# EAGLE schematic raceCapture (EAGLE 5.09)

## Sheet 1 of 4
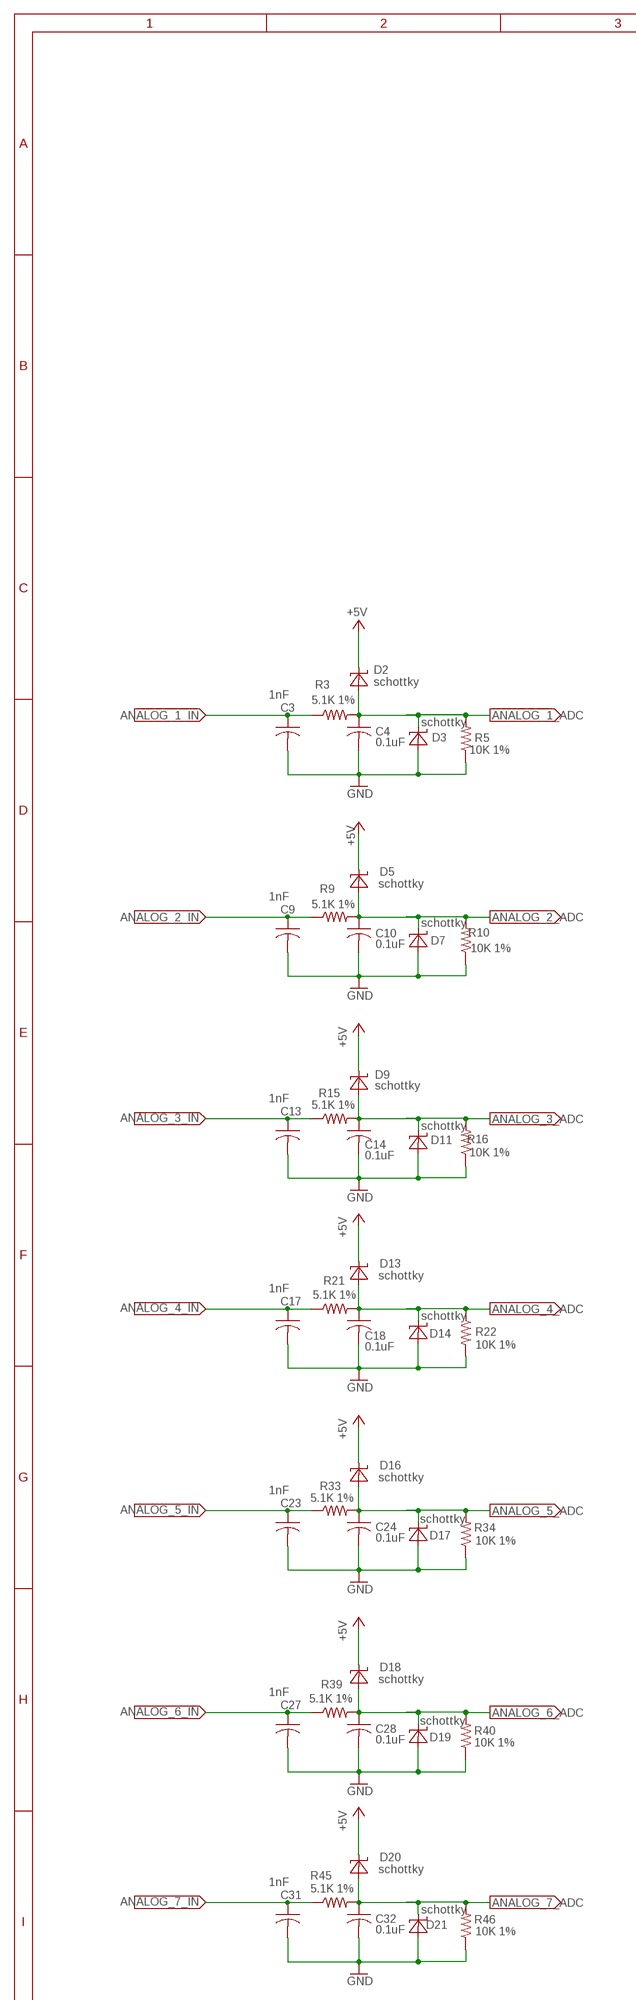
[diagram p0: schematic, sheet 1, part 1 of 2]
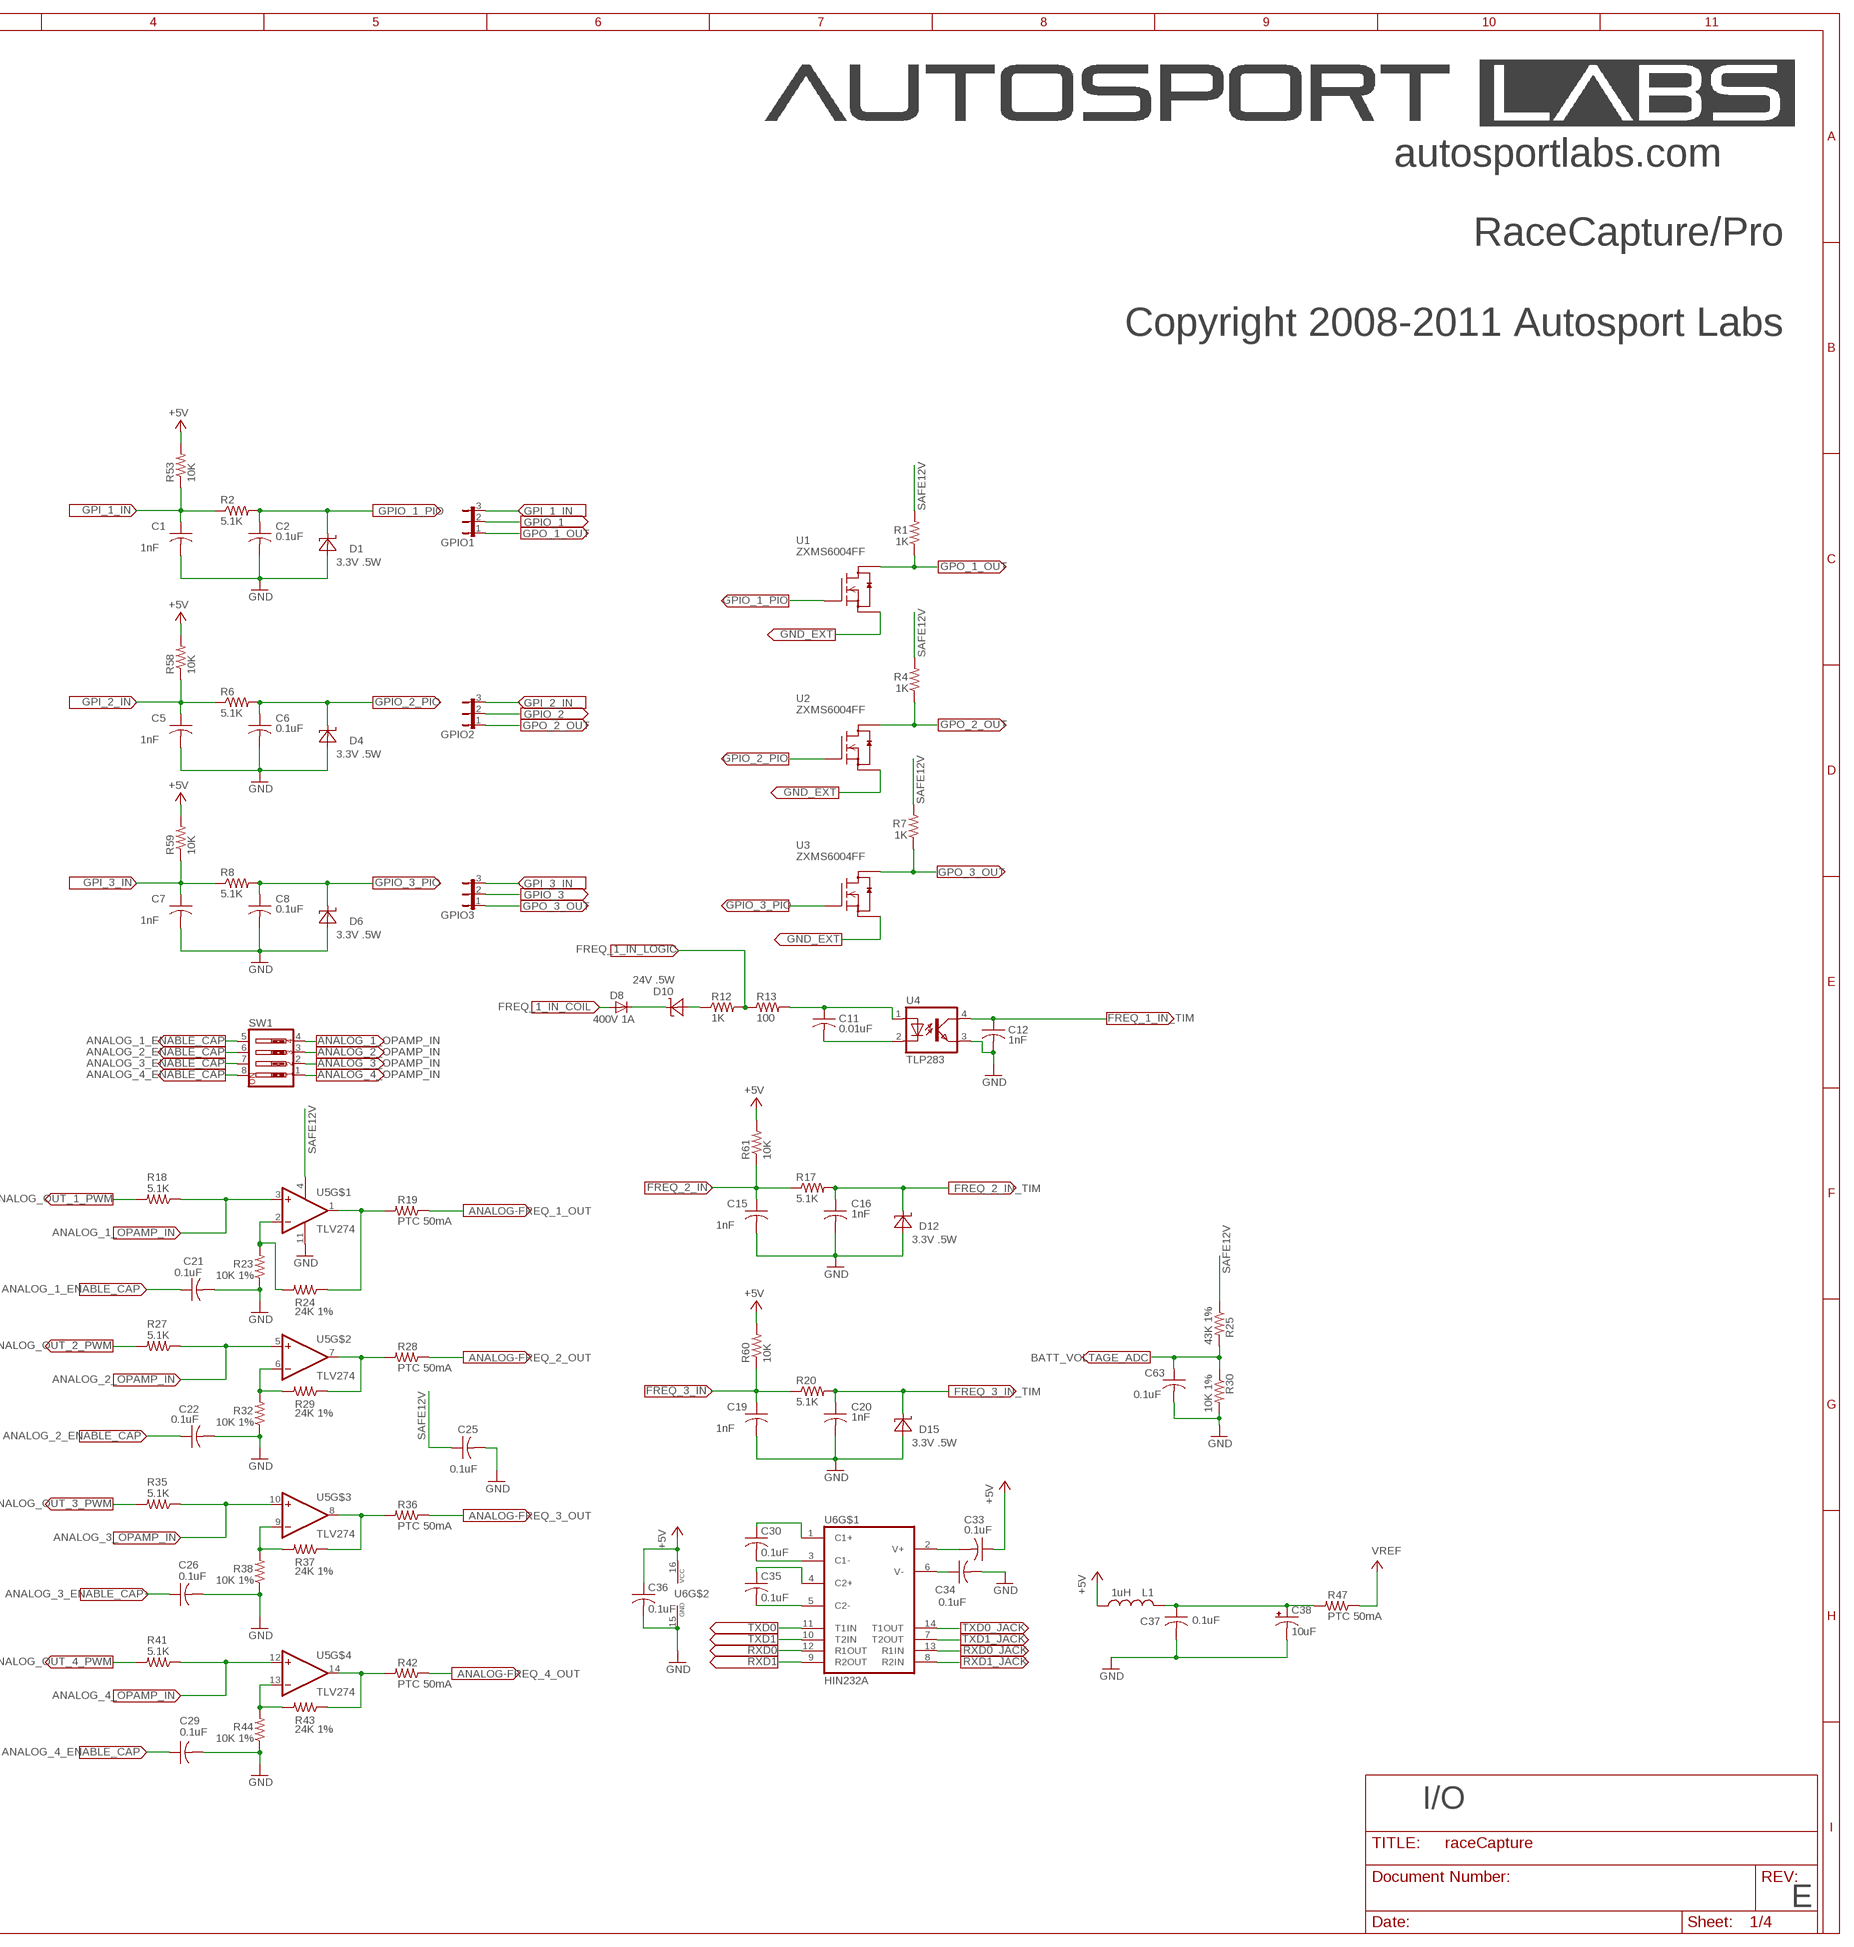
[diagram p1: schematic, sheet 1, part 2 of 2]

### Parts
C1  1nF  C-USC0603  [C0603]
C2  0.1uF  C-USC0603  [C0603]
C3  1nF  C-USC0603  [C0603]
C4  0.1uF  C-USC0603  [C0603]
C5  1nF  C-USC0603  [C0603]
C6  0.1uF  C-USC0603  [C0603]
C7  1nF  C-USC0603  [C0603]
C8  0.1uF  C-USC0603  [C0603]
C9  1nF  C-USC0603  [C0603]
C10  0.1uF  C-USC0603  [C0603]
C11  0.01uF  C-USC0603  [C0603]
C12  1nF  C-USC0603  [C0603]
C13  1nF  C-USC0603  [C0603]
C14  0.1uF  C-USC0603  [C0603]
C15  1nF  C-USC0603  [C0603]
C16  1nF  C-USC0603  [C0603]
C17  1nF  C-USC0603  [C0603]
C18  0.1uF  C-USC0603  [C0603]
C19  1nF  C-USC0603  [C0603]
C20  1nF  C-USC0603  [C0603]
C21  0.1uF  C-USC0603  [C0603]
C22  0.1uF  C-USC0603  [C0603]
C23  1nF  C-USC0603  [C0603]
C24  0.1uF  C-USC0603  [C0603]
C25  0.1uF  C-USC0603  [C0603]
C26  0.1uF  C-USC0603  [C0603]
C27  1nF  C-USC0603  [C0603]
C28  0.1uF  C-USC0603  [C0603]
C29  0.1uF  C-USC0603  [C0603]
C30  0.1uF  C-USC0603  [C0603]
C31  1nF  C-USC0603  [C0603]
C32  0.1uF  C-USC0603  [C0603]
C33  0.1uF  C-USC0603  [C0603]
C34  0.1uF  C-USC0603  [C0603]
C35  0.1uF  C-USC0603  [C0603]
C36  0.1uF  C-USC0603  [C0603]
C37  0.1uF  C-USC0603  [C0603]
C38  10uF  CPOL-USSMCA  [SMC_A]
C63  0.1uF  C-USC0603  [C0603]
D1  3.3V .5W  ZENER2  [SOD123]
D2  schottky  ZENER2  [SOD123]
D3  schottky  ZENER2  [SOD123]
D4  3.3V .5W  ZENER2  [SOD123]
D5  schottky  ZENER2  [SOD123]
D6  3.3V .5W  ZENER2  [SOD123]
D7  schottky  ZENER2  [SOD123]
D8  400V 1A  DIODE1  [SMA]
D9  schottky  ZENER2  [SOD123]
D10  24V .5W  ZENER2  [SOD123]
D11  schottky  ZENER2  [SOD123]
D12  3.3V .5W  ZENER2  [SOD123]
D13  schottky  ZENER2  [SOD123]
D14  schottky  ZENER2  [SOD123]
D15  3.3V .5W  ZENER2  [SOD123]
D16  schottky  ZENER2  [SOD123]
D17  schottky  ZENER2  [SOD123]
D18  schottky  ZENER2  [SOD123]
D19  schottky  ZENER2  [SOD123]
D20  schottky  ZENER2  [SOD123]
D21  schottky  ZENER2  [SOD123]
GPIO1  JP2E  [JP2]
GPIO2  JP2E  [JP2]
GPIO3  JP2E  [JP2]
L1  1uH  INDUCTOR  [1210]
R1  1K  R-US_R1206  [R1206]
R2  5.1K  R-US_R0603  [R0603]
R3  5.1K 1%  R-US_R0603  [R0603]
R4  1K  R-US_R1206  [R1206]
R5  10K 1%  R-US_R0603  [R0603]
R6  5.1K  R-US_R0603  [R0603]
R7  1K  R-US_R1206  [R1206]
R8  5.1K  R-US_R0603  [R0603]
R9  5.1K 1%  R-US_R0603  [R0603]
R10  10K 1%  R-US_R0603  [R0603]
R12  1K  R-US_R1206  [R1206]
R13  100  R-US_R0603  [R0603]
R15  5.1K 1%  R-US_R0603  [R0603]
R16  10K 1%  R-US_R0603  [R0603]
R17  5.1K  R-US_R0603  [R0603]
R18  5.1K  R-US_R0603  [R0603]
R19  PTC 50mA  R-US_R1206  [R1206]
R20  5.1K  R-US_R0603  [R0603]
R21  5.1K 1%  R-US_R0603  [R0603]
R22  10K 1%  R-US_R0603  [R0603]
R23  10K 1%  R-US_R0603  [R0603]
R24  24K 1%  R-US_R0603  [R0603]
R25  43K 1%  R-US_R0603  [R0603]
R27  5.1K  R-US_R0603  [R0603]
R28  PTC 50mA  R-US_R1206  [R1206]
R29  24K 1%  R-US_R0603  [R0603]
R30  10K 1%  R-US_R0603  [R0603]
R32  10K 1%  R-US_R0603  [R0603]
R33  5.1K 1%  R-US_R0603  [R0603]
R34  10K 1%  R-US_R0603  [R0603]
R35  5.1K  R-US_R0603  [R0603]
R36  PTC 50mA  R-US_R1206  [R1206]
R37  24K 1%  R-US_R0603  [R0603]
R38  10K 1%  R-US_R0603  [R0603]
R39  5.1K 1%  R-US_R0603  [R0603]
R40  10K 1%  R-US_R0603  [R0603]
R41  5.1K  R-US_R0603  [R0603]
R42  PTC 50mA  R-US_R1206  [R1206]
R43  24K 1%  R-US_R0603  [R0603]
R44  10K 1%  R-US_R0603  [R0603]
R45  5.1K 1%  R-US_R0603  [R0603]
R46  10K 1%  R-US_R0603  [R0603]
R47  PTC 50mA  R-US_R1206  [R1206]
R53  10K  R-US_R0603  [R0603]
R58  10K  R-US_R0603  [R0603]
R59  10K  R-US_R0603  [R0603]
R60  10K  R-US_R0603  [R0603]
R61  10K  R-US_R0603  [R0603]
SW1  SW_DIP-4  [EDG-04]
U1  ZXMS6004FF  [SOT-23]
U2  ZXMS6004FF  [SOT-23]
U3  ZXMS6004FF  [SOT-23]
U4  TLP283  [MINI-FLAT-4]
U5  TLV274  TLV274SO14  [SO14]
U6  HIN232A  [SOIC-16]

### Nets
+5V: C33.1 C36.1 D2.C D5.C D9.C D13.C D16.C D18.C D20.C L1.1 R53.2 R58.2 R59.2 R60.2 R61.2 U6.16(VCC) ; also sheet 2,3,4
ANALOG-FREQ_1_OPAMP_OUT: R19.2 R24.1 U5.1(OUT)
ANALOG-FREQ_1_OUT: R19.1 ; also sheet 4
ANALOG-FREQ_2_OPAMP_OUT: R28.2 R29.1 U5.7(OUT)
ANALOG-FREQ_2_OUT: R28.1 ; also sheet 4
ANALOG-FREQ_3_OPAMP_OUT: R36.2 R37.1 U5.8(OUT)
ANALOG-FREQ_3_OUT: R36.1 ; also sheet 4
ANALOG-FREQ_4_OPAMP_OUT: R42.2 R43.1 U5.14(OUT)
ANALOG-FREQ_4_OUT: R42.1 ; also sheet 4
ANALOG_1_ADC: C4.1 D2.A D3.C R3.2 R5.2 ; also sheet 2
ANALOG_1_ENABLE_CAP: C21.1 SW1.5
ANALOG_1_IN: C3.1 R3.1 ; also sheet 4
ANALOG_1_OPAMP_IN: R18.1 SW1.4 U5.3(+IN)
ANALOG_2_ADC: C10.1 D5.A D7.C R9.2 R10.2 ; also sheet 2
ANALOG_2_ENABLE_CAP: C22.1 SW1.6
ANALOG_2_IN: C9.1 R9.1 ; also sheet 4
ANALOG_2_OPAMP_IN: R27.1 SW1.3 U5.5(+IN)
ANALOG_3_ADC: C14.1 D9.A D11.C R15.2 R16.2 ; also sheet 2
ANALOG_3_ENABLE_CAP: C26.1 SW1.7
ANALOG_3_IN: C13.1 R15.1 ; also sheet 4
ANALOG_3_OPAMP_IN: R35.1 SW1.2 U5.10(+IN)
ANALOG_4_ADC: C18.1 D13.A D14.C R21.2 R22.1 ; also sheet 2
ANALOG_4_ENABLE_CAP: C29.1 SW1.8
ANALOG_4_IN: C17.1 R21.1 ; also sheet 4
ANALOG_4_OPAMP_IN: R41.1 SW1.1 U5.12(+IN)
ANALOG_5_ADC: C24.1 D16.A D17.C R33.2 R34.2 ; also sheet 2
ANALOG_5_IN: C23.1 R33.1 ; also sheet 4
ANALOG_6_ADC: C28.1 D18.A D19.C R39.2 R40.2 ; also sheet 2
ANALOG_6_IN: C27.1 R39.1 ; also sheet 4
ANALOG_7_ADC: C32.1 D20.A D21.C R45.2 R46.2 ; also sheet 2
ANALOG_7_IN: C31.1 R45.1 ; also sheet 4
ANALOG_OUT_1_PWM: R18.2 ; also sheet 2
ANALOG_OUT_2_PWM: R27.2 ; also sheet 2
ANALOG_OUT_3_PWM: R35.2 ; also sheet 2
ANALOG_OUT_4_PWM: R41.2 ; also sheet 2
BATT_VOLTAGE_ADC: C63.1 R25.2 R30.1 ; also sheet 2
FREQ_1_IN_COIL: D8.A ; also sheet 4
FREQ_1_IN_LOGIC: R12.2 R13.1
FREQ_1_IN_TIM: C12.1 U4.4(COL) ; also sheet 2
FREQ_2_IN: C15.1 R17.1 R61.1 ; also sheet 4
FREQ_2_IN_TIM: C16.1 D12.C R17.2 ; also sheet 2
FREQ_3_IN: C19.1 R20.1 R60.1 ; also sheet 4
FREQ_3_IN_TIM: C20.1 D15.C R20.2 ; also sheet 2
GND: C1.2 C2.2 C3.2 C4.2 C5.2 C6.2 C7.2 C8.2 C9.2 C10.2 C12.2 C13.2 C14.2 C15.2 C16.2 C17.2 C18.2 C19.2 C20.2 C21.2 C22.2 C23.2 C24.2 C25.2 C26.2 C27.2 C28.2 C29.2 C31.2 C32.2 C34.2 C36.2 C37.2 C38.- C63.2 D1.A D3.A D4.A D6.A D7.A D11.A D12.A D14.A D15.A D17.A D19.A D21.A R5.1 R10.1 R16.1 R22.2 R23.1 R30.2 R32.1 R34.1 R38.1 R40.1 R44.1 R46.1 U4.3(EMIT) U5.11(V-) U6.15(GND) ; also sheet 2,3,4
GND_EXT: C11.2 U1.2(S1) U2.2(S1) U3.2(S1) U4.2(C) ; also sheet 4
GPI_1_IN: C1.1 GPIO1.3 R2.1 R53.1
GPI_2_IN: C5.1 GPIO2.3 R6.1 R58.1
GPI_3_IN: C7.1 GPIO3.3 R8.1 R59.1
GPIO_1: GPIO1.2 ; also sheet 4
GPIO_1_PIO: C2.1 D1.C R2.2 U1.1(G) ; also sheet 2
GPIO_2: GPIO2.2 ; also sheet 4
GPIO_2_PIO: C6.1 D4.C R6.2 U2.1(G) ; also sheet 2
GPIO_3: GPIO3.2 ; also sheet 4
GPIO_3_PIO: C8.1 D6.C R8.2 U3.1(G) ; also sheet 2
GPO_1_OUT: GPIO1.1 R1.1 U1.3(D1)
GPO_2_OUT: GPIO2.1 R4.1 U2.3(D1)
GPO_3_OUT: GPIO3.1 R7.1 U3.3(D1)
N$1: D10.A R12.1
N$3: C11.1 R13.2 U4.1(A)
N$5: D8.C D10.C
N$8: R29.2 R32.2 U5.6(-IN)
N$10: R23.2 R24.2 U5.2(-IN)
N$12: R37.2 R38.2 U5.9(-IN)
N$14: R43.2 R44.2 U5.13(-IN)
N$16: C30.1 U6.1(C1+)
N$17: C30.2 U6.3(C1-)
N$18: C35.1 U6.4(C2+)
N$19: C35.2 U6.5(C2-)
N$20: C33.2 U6.2(V+)
N$21: C34.1 U6.6(V-)
RXD0: U6.12(R1OUT) ; also sheet 2
RXD0_JACK: U6.13(R1IN) ; also sheet 4
RXD1: U6.9(R2OUT) ; also sheet 2
RXD1_JACK: U6.8(R2IN) ; also sheet 4
SAFE12V: C25.1 R1.2 R4.2 R7.2 R25.1 U5.4(V+) ; also sheet 3
TXD0: U6.11(T1IN) ; also sheet 2
TXD0_JACK: U6.14(T1OUT) ; also sheet 4
TXD1: U6.10(T2IN) ; also sheet 2
TXD1_JACK: U6.7(T2OUT) ; also sheet 4
VREF: R47.1 ; also sheet 4
VREF_PROTECT: C37.1 C38.+ L1.2 R47.2

### Notes on the sheet
- autosportlabs.com
- RaceCapture/Pro
- Copyright 2008-2011 Autosport Labs
- I/O
- E

## Sheet 2 of 4
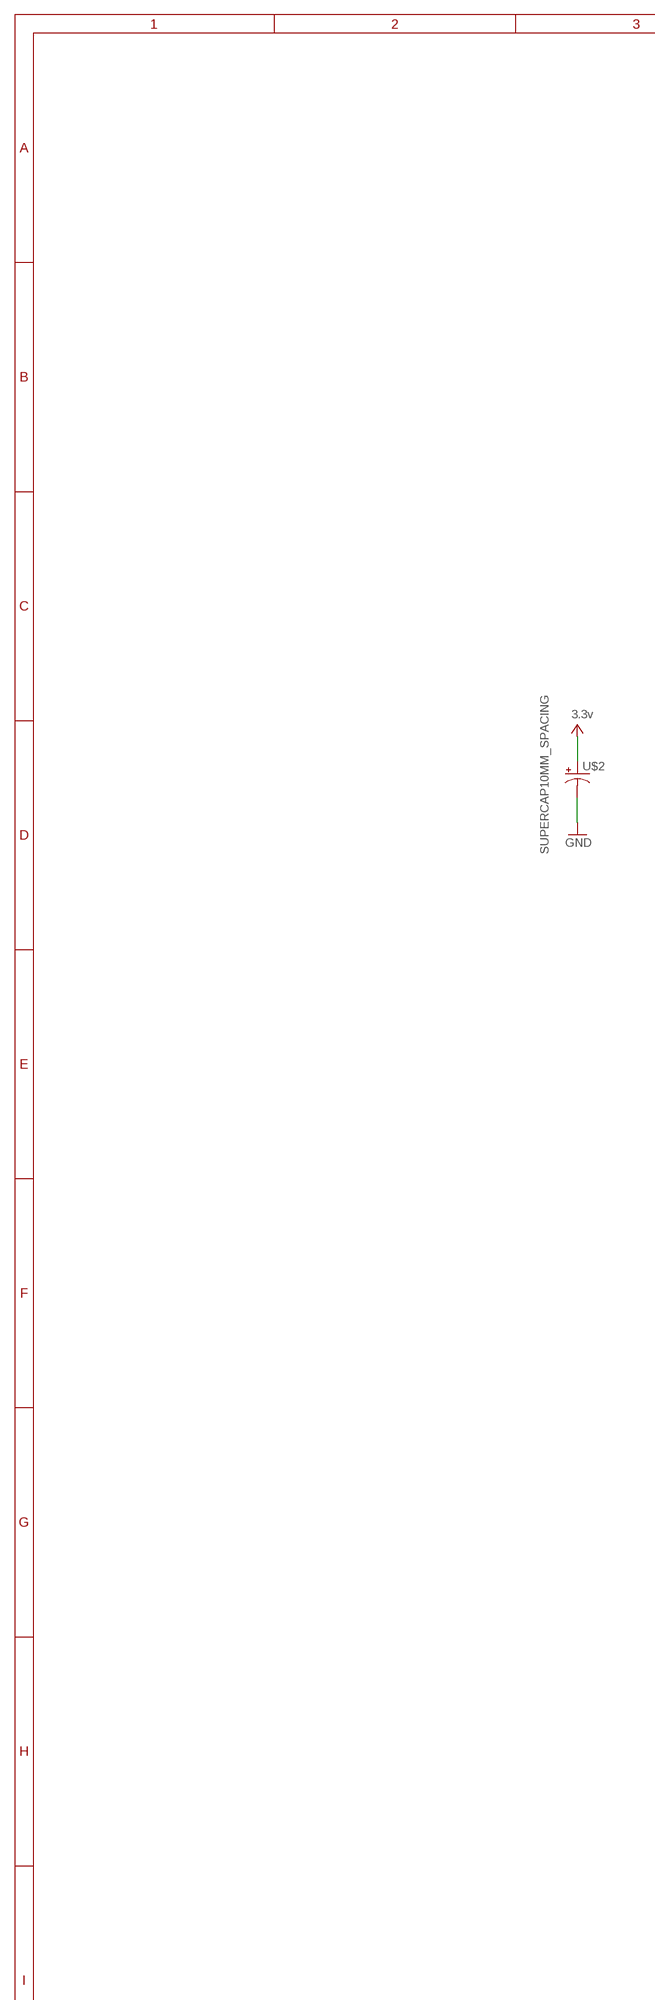
[diagram p2: schematic, sheet 2, part 1 of 2]
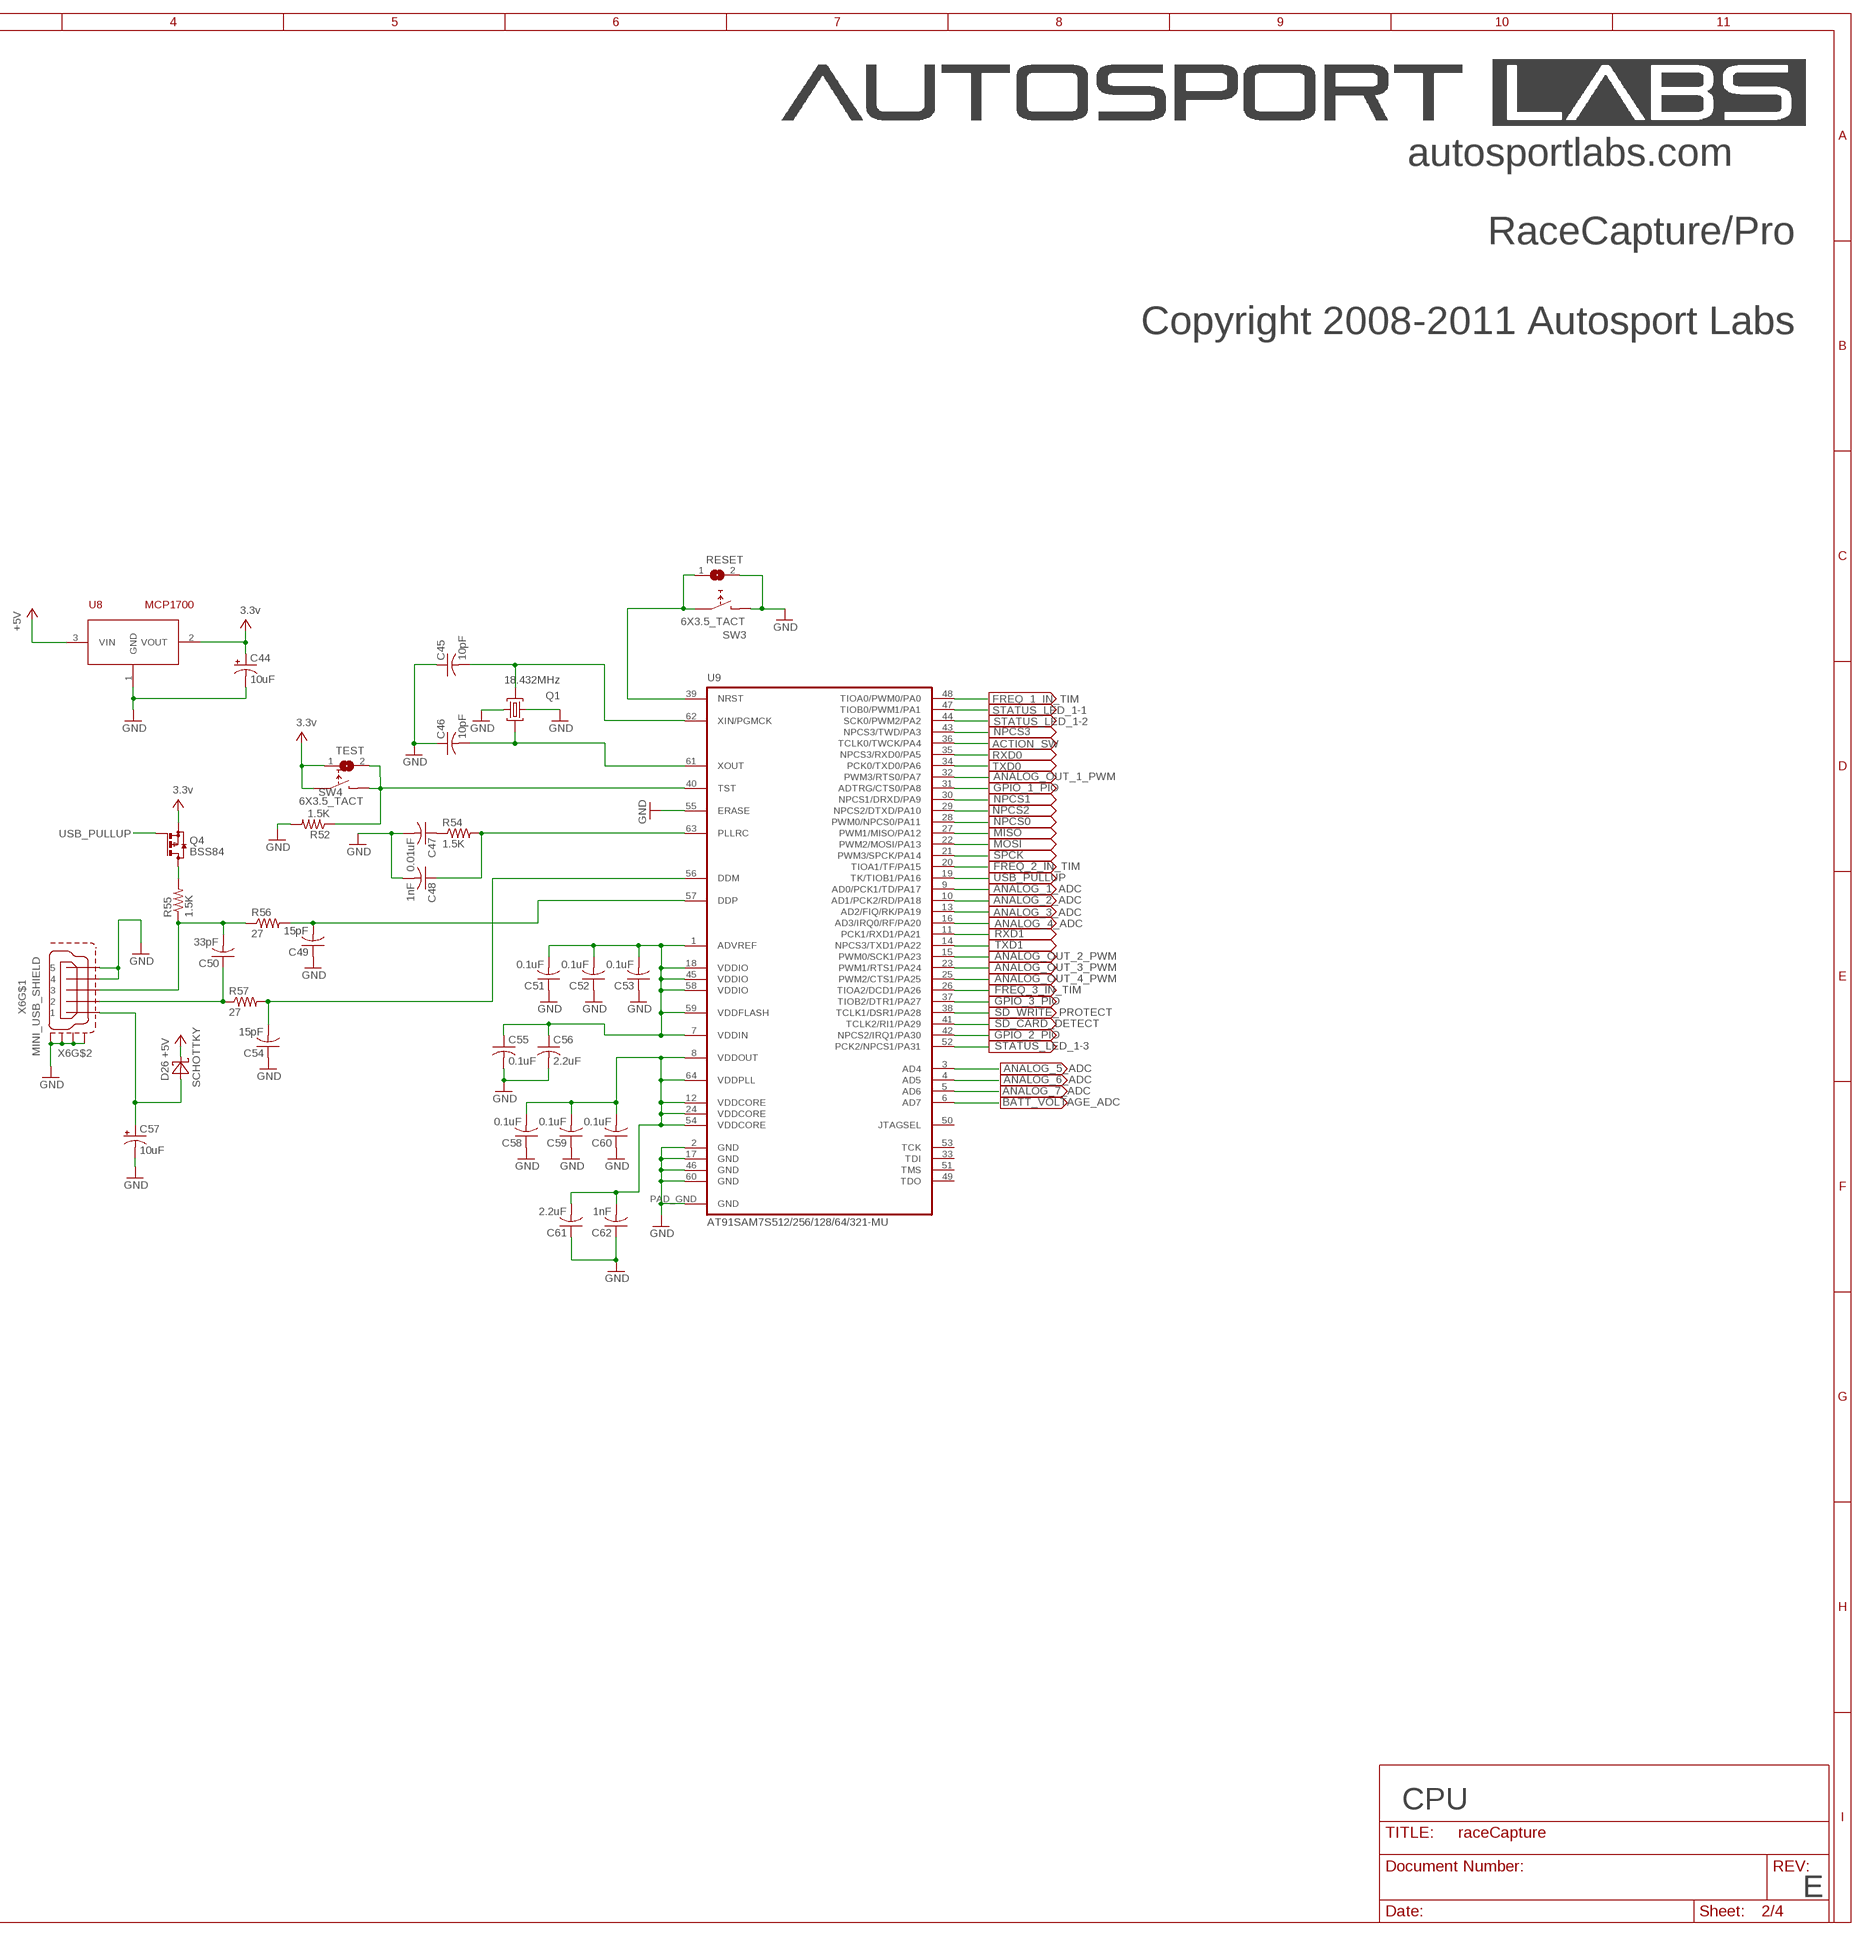
[diagram p3: schematic, sheet 2, part 2 of 2]

### Parts
C44  10uF  CPOL-USSMCA  [SMC_A]
C45  10pF  C-USC0603  [C0603]
C46  10pF  C-USC0603  [C0603]
C47  0.01uF  C-USC0603  [C0603]
C48  1nF  C-USC0603  [C0603]
C49  15pF  C-USC0603  [C0603]
C50  33pF  C-USC0603  [C0603]
C51  0.1uF  C-USC0603  [C0603]
C52  0.1uF  C-USC0603  [C0603]
C53  0.1uF  C-USC0603  [C0603]
C54  15pF  C-USC0603  [C0603]
C55  0.1uF  C-USC0603  [C0603]
C56  2.2uF  C-USC0603  [C0603]
C57  10uF  CPOL-USSMCA  [SMC_A]
C58  0.1uF  C-USC0603  [C0603]
C59  0.1uF  C-USC0603  [C0603]
C60  0.1uF  C-USC0603  [C0603]
C61  2.2uF  C-USC0603  [C0603]
C62  1nF  C-USC0603  [C0603]
D26  SCHOTTKY  [SMA]
Q1  18.432MHz  ABM8X2  [5X3.2]
Q4  BSS84  [SOT23]
R52  1.5K  R-US_R0603  [R0603]
R54  1.5K  R-US_R0603  [R0603]
R55  1.5K  R-US_R0603  [R0603]
R56  27  R-US_R0603  [R0603]
R57  27  R-US_R0603  [R0603]
RESET  SJ  [SJ]
SW3  6X3.5_TACT  [TACT_6X3.5]
SW4  6X3.5_TACT  [TACT_6X3.5]
TEST  SJ  [SJ]
U8  MCP1700  [SOT-23]
U9  AT91SAM7S512/256/128/64/321-MU  [QFN64]
U$2  SUPERCAP10MM_SPACING  [10MM_SPACING-CAP]
X6  MINI_USB_SHIELD  [MINI-USB_JACK]

### Nets
+5V: D26.C U8.3(VIN) ; also sheet 1,3,4
ACTION_SW: U9.36(TCLK0/TWCK/PA4) ; also sheet 4
ANALOG_1_ADC: U9.9(AD0/PCK1/TD/PA17) ; also sheet 1
ANALOG_2_ADC: U9.10(AD1/PCK2/RD/PA18) ; also sheet 1
ANALOG_3_ADC: U9.13(AD2/FIQ/RK/PA19) ; also sheet 1
ANALOG_4_ADC: U9.16(AD3/IRQ0/RF/PA20) ; also sheet 1
ANALOG_5_ADC: U9.3(AD4) ; also sheet 1
ANALOG_6_ADC: U9.4(AD5) ; also sheet 1
ANALOG_7_ADC: U9.5(AD6) ; also sheet 1
ANALOG_OUT_1_PWM: U9.32(PWM3/RTS0/PA7) ; also sheet 1
ANALOG_OUT_2_PWM: U9.15(PWM0/SCK1/PA23) ; also sheet 1
ANALOG_OUT_3_PWM: U9.23(PWM1/RTS1/PA24) ; also sheet 1
ANALOG_OUT_4_PWM: U9.25(PWM2/CTS1/PA25) ; also sheet 1
BATT_VOLTAGE_ADC: U9.6(AD7) ; also sheet 1
DDM: C54.2 R57.2 U9.56(DDM)
DDP: C49.2 R56.2 U9.57(DDP)
FREQ_1_IN_TIM: U9.48(TIOA0/PWM0/PA0) ; also sheet 1
FREQ_2_IN_TIM: U9.20(TIOA1/TF/PA15) ; also sheet 1
FREQ_3_IN_TIM: U9.26(TIOA2/DCD1/PA26) ; also sheet 1
GND: C44.- C45.1 C46.1 C47.2 C48.2 C49.1 C51.1 C52.1 C53.1 C54.1 C55.2 C56.2 C57.- C58.1 C59.1 C60.1 C61.1 C62.1 Q1.2(CRYSTAL1) Q1.4(CRYSTAL2) R52.2 RESET.2 SW3.P$2 U8.1(GND) U9.2(GND) U9.17(GND) U9.46(GND) U9.55(ERASE) U9.60(GND) U9.PAD_GND(GND) U$2.P-(-) X6.4 X6.5 X6.M1(S1) X6.M2(S2) X6.M3(S3) X6.M4(S4) ; also sheet 1,3,4
GPIO_1_PIO: U9.31(ADTRG/CTS0/PA8) ; also sheet 1
GPIO_2_PIO: U9.42(NPCS2/IRQ1/PA30) ; also sheet 1
GPIO_3_PIO: U9.37(TIOB2/DTR1/PA27) ; also sheet 1
MISO: U9.27(PWM1/MISO/PA12) ; also sheet 4
MOSI: U9.22(PWM2/MOSI/PA13) ; also sheet 4
N$4: Q4.3(D) R55.2
N$40: C47.1 R54.1
N$100: R52.1 SW4.P$2 TEST.2 U9.40(TST)
N$300: C50.2 R55.1 R56.1 X6.3
N$400: C50.1 R57.1 X6.2
NPCS0: U9.28(PWM0/NPCS0/PA11) ; also sheet 4
NPCS1: U9.30(NPCS1/DRXD/PA9) ; also sheet 4
NPCS2: U9.29(NPCS2/DTXD/PA10) ; also sheet 4
NPCS3: U9.43(NPCS3/TWD/PA3)
PLLRC: C48.1 R54.2 U9.63(PLLRC)
RESET: RESET.1 SW3.P$1 U9.39(NRST)
RXD0: U9.35(NPCS3/RXD0/PA5) ; also sheet 1
RXD1: U9.11(PCK1/RXD1/PA21) ; also sheet 1
SD_CARD_DETECT: U9.41(TCLK2/RI1/PA29) ; also sheet 4
SD_WRITE_PROTECT: U9.38(TCLK1/DSR1/PA28) ; also sheet 4
SPCK: U9.21(PWM3/SPCK/PA14) ; also sheet 4
STATUS_LED_1-1: U9.47(TIOB0/PWM1/PA1) ; also sheet 4
STATUS_LED_1-2: U9.44(SCK0/PWM2/PA2) ; also sheet 4
STATUS_LED_1-3: U9.52(PCK2/NPCS1/PA31) ; also sheet 4
TXD0: U9.34(PCK0/TXD0/PA6) ; also sheet 1
TXD1: U9.14(NPCS3/TXD1/PA22) ; also sheet 1
USB_PULLUP: Q4.1(G) U9.19(TK/TIOB1/PA16)
V+: C44.+ C51.2 C52.2 C53.2 C55.1 C56.1 Q4.2(S) SW4.P$1 TEST.1 U8.2(VOUT) U9.1(ADVREF) U9.7(VDDIN) U9.18(VDDIO) U9.45(VDDIO) U9.58(VDDIO) U9.59(VDDFLASH) U$2.P+(+) ; supply symbol labelled 3.3v ; also sheet 4
VBUS: C57.+ D26.A X6.1
VDDOUT: C58.2 C59.2 C60.2 C61.2 C62.2 U9.8(VDDOUT) U9.12(VDDCORE) U9.24(VDDCORE) U9.54(VDDCORE) U9.64(VDDPLL)
XIN1: C46.2 Q1.1(GND1) U9.61(XOUT)
XOUT1: C45.2 Q1.3(GND2) U9.62(XIN/PGMCK)
Unconnected: U9.33(TDI) U9.49(TDO) U9.50(JTAGSEL) U9.51(TMS) U9.53(TCK)

### Notes on the sheet
- autosportlabs.com
- RaceCapture/Pro
- Copyright 2008-2011 Autosport Labs
- CPU
- E

## Sheet 3 of 4
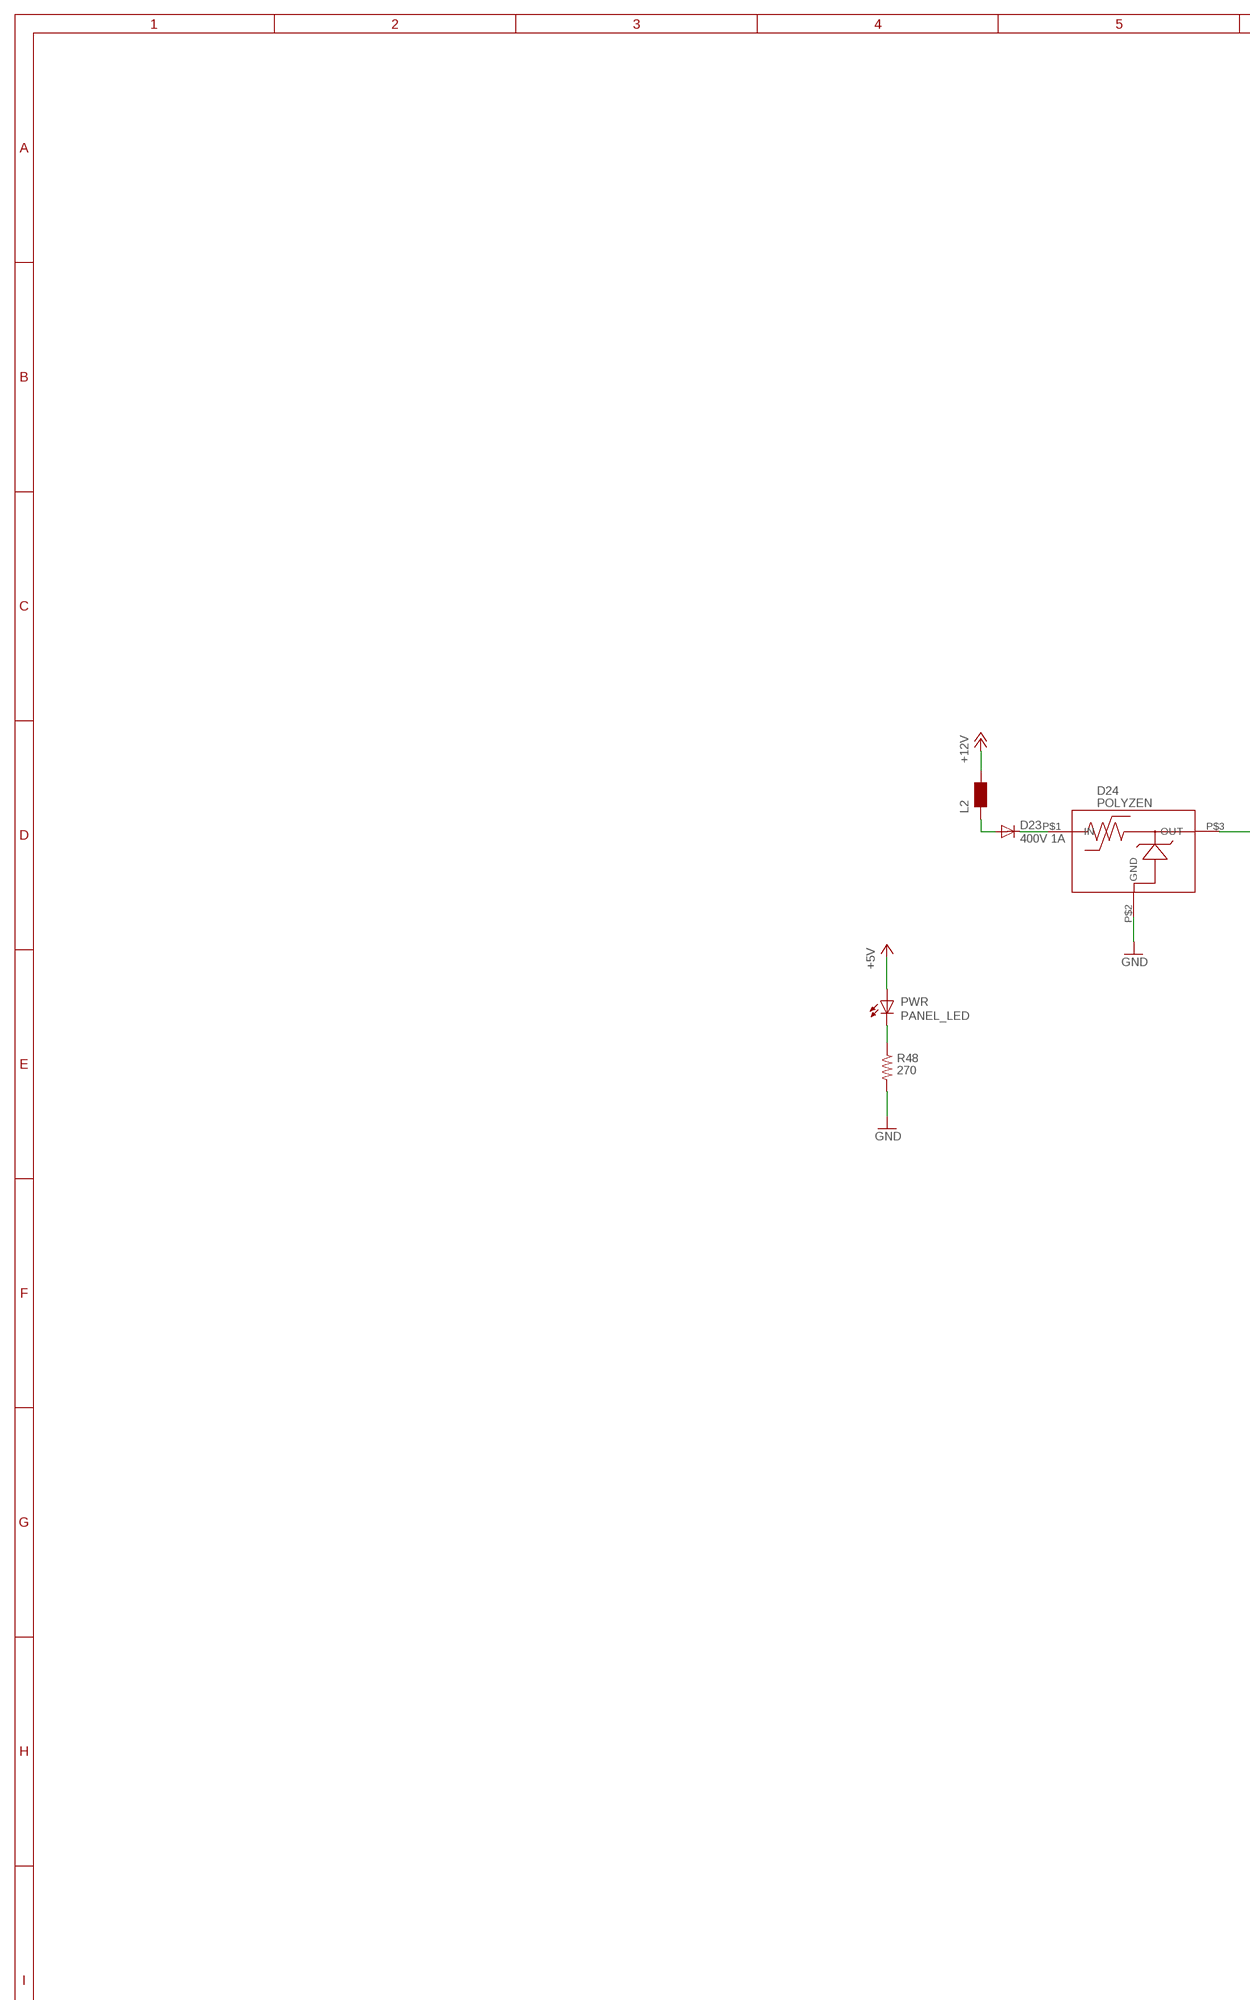
[diagram p4: schematic, sheet 3, part 1 of 2]
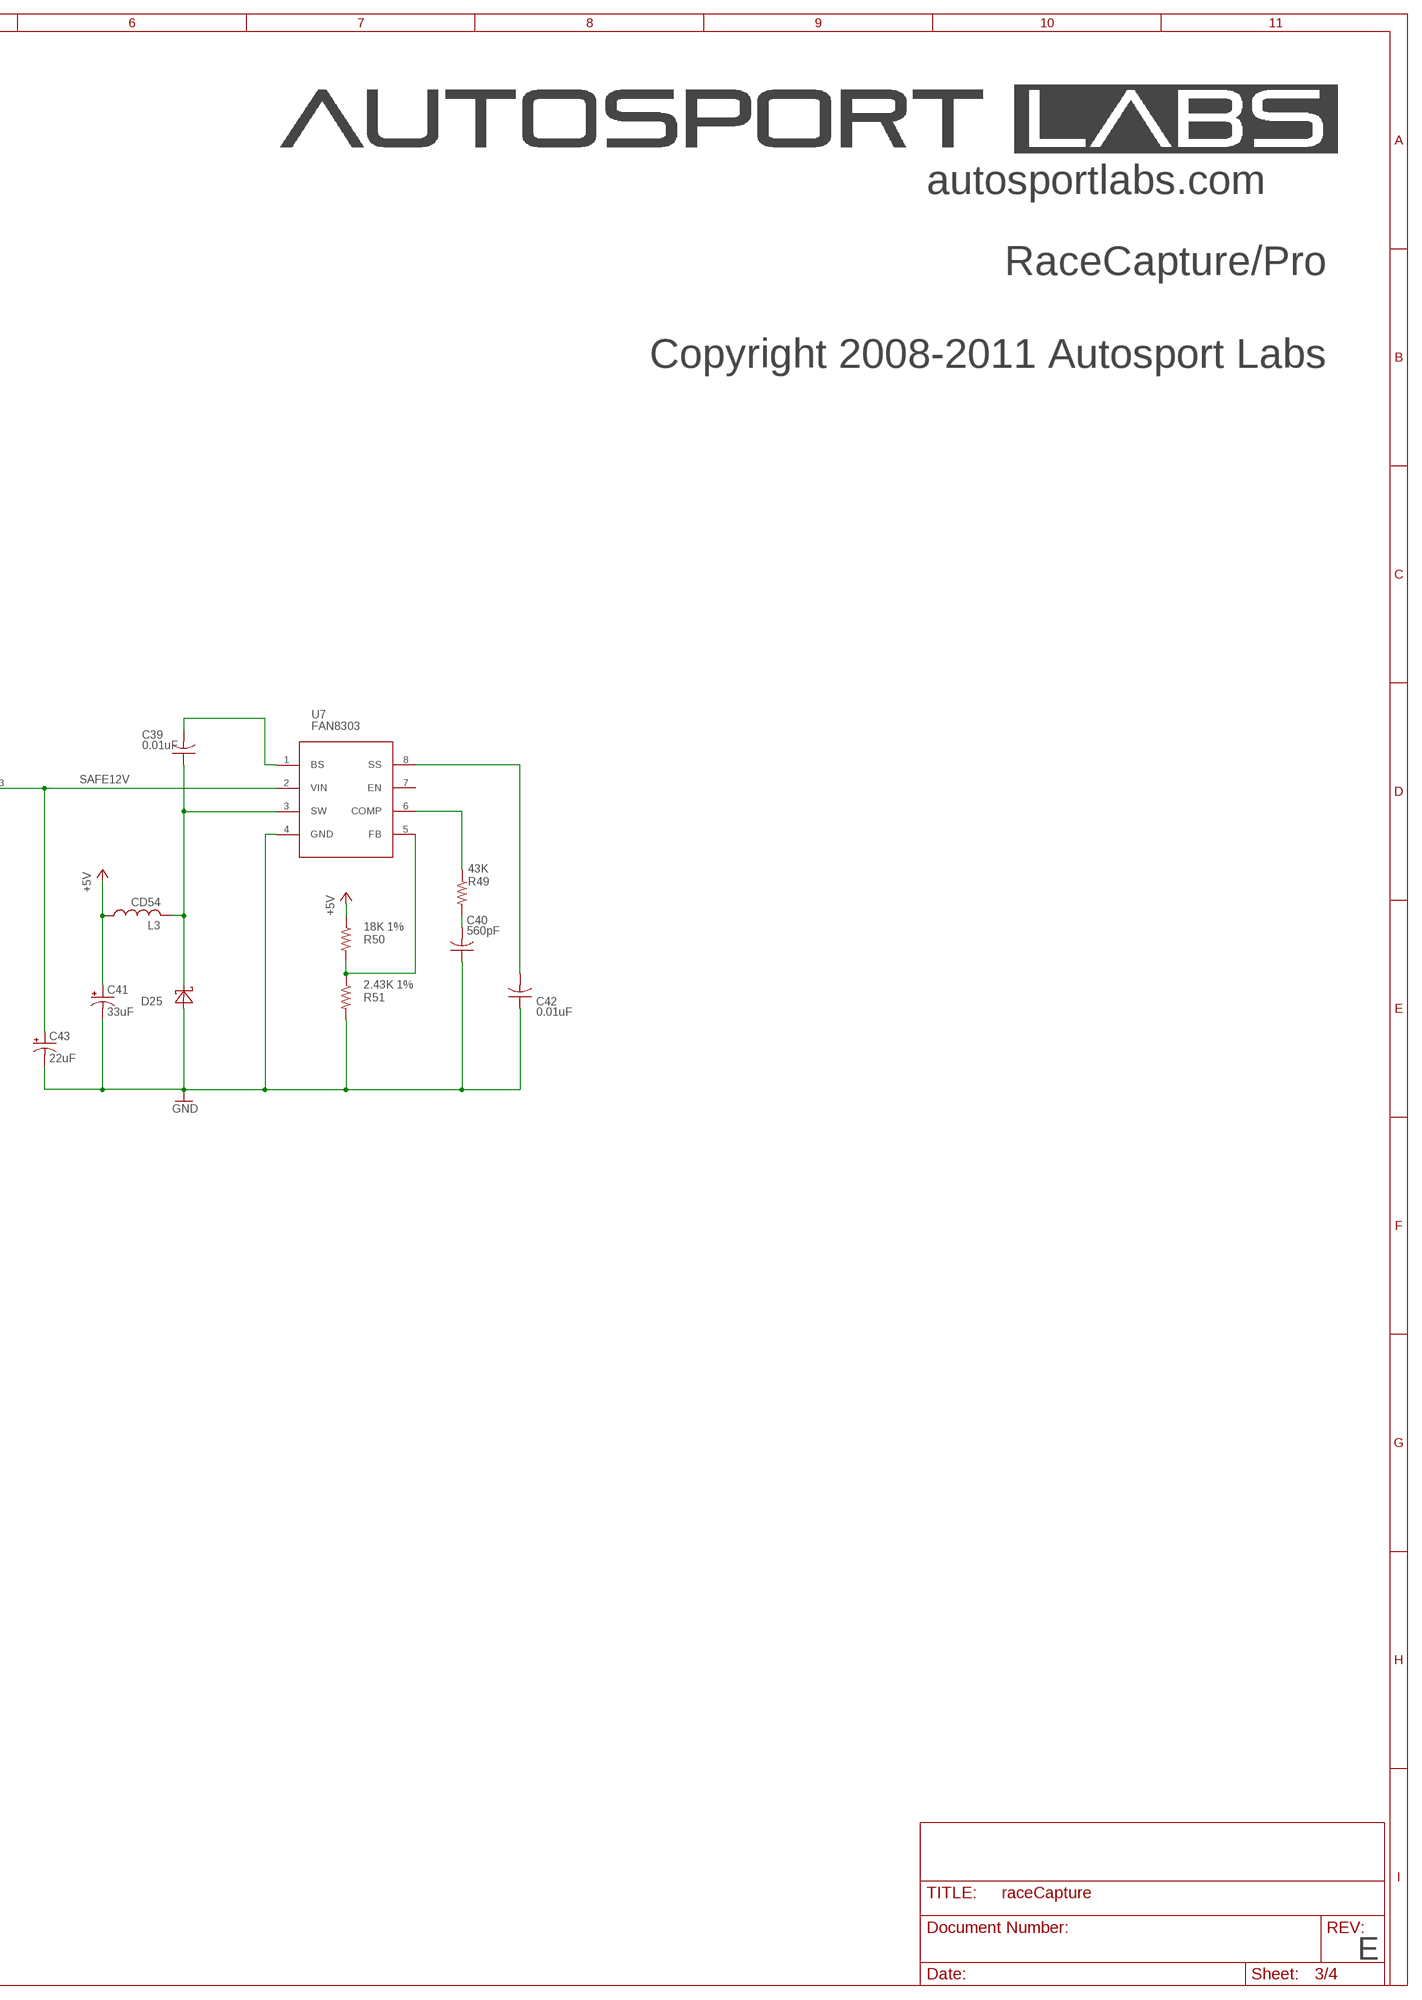
[diagram p5: schematic, sheet 3, part 2 of 2]

### Parts
C39  0.01uF  C-USC0603  [C0603]
C40  560pF  C-USC0603  [C0603]
C41  33uF  CPOL-USSMCD  [SMC_D]
C42  0.01uF  C-USC0603  [C0603]
C43  22uF  CPOL-US153CLV-0605  [153CLV-0605]
D23  400V 1A  DIODE1  [SMA]
D24  POLYZEN  [POLYZEN]
D25  SCHOTTKY  [SMA]
L2  WE-CBF_1812  [1812]
L3  CD54  [CD54]
PWR  PANEL_LED  [RIGHTANGLE_CML_5323F5]
R48  270  R-US_R0603  [R0603]
R49  43K  R-US_R0603  [R0603]
R50  18K 1%  R-US_R0603  [R0603]
R51  2.43K 1%  R-US_R0603  [R0603]
U7  FAN8303  [SO-8]

### Nets
$N2000: D23.C D24.P$1(IN)
+5V: C41.+ L3.P$1 PWR.A R50.1 ; also sheet 1,2,4
+12V: L2.2 ; also sheet 4
GND: C40.1 C41.- C42.1 C43.- D24.P$2(GND) D25.A R48.2 R51.2 U7.4(GND) ; also sheet 1,2,4
N$22: PWR.C R48.1
N$800: R50.2 R51.1 U7.5(FB)
N$900: C39.2 U7.1(BS)
N$1000: C39.1 D25.C L3.P$2 U7.3(SW)
N$1100: C40.2 R49.2
N$1200: R49.1 U7.6(COMP)
N$1300: C42.2 U7.8(SS)
N$1500: D23.A L2.1
SAFE12V: C43.+ D24.P$3(OUT) U7.2(VIN) ; also sheet 1
Unconnected: U7.7(EN)

### Notes on the sheet
- autosportlabs.com
- RaceCapture/Pro
- Copyright 2008-2011 Autosport Labs
- E

## Sheet 4 of 4
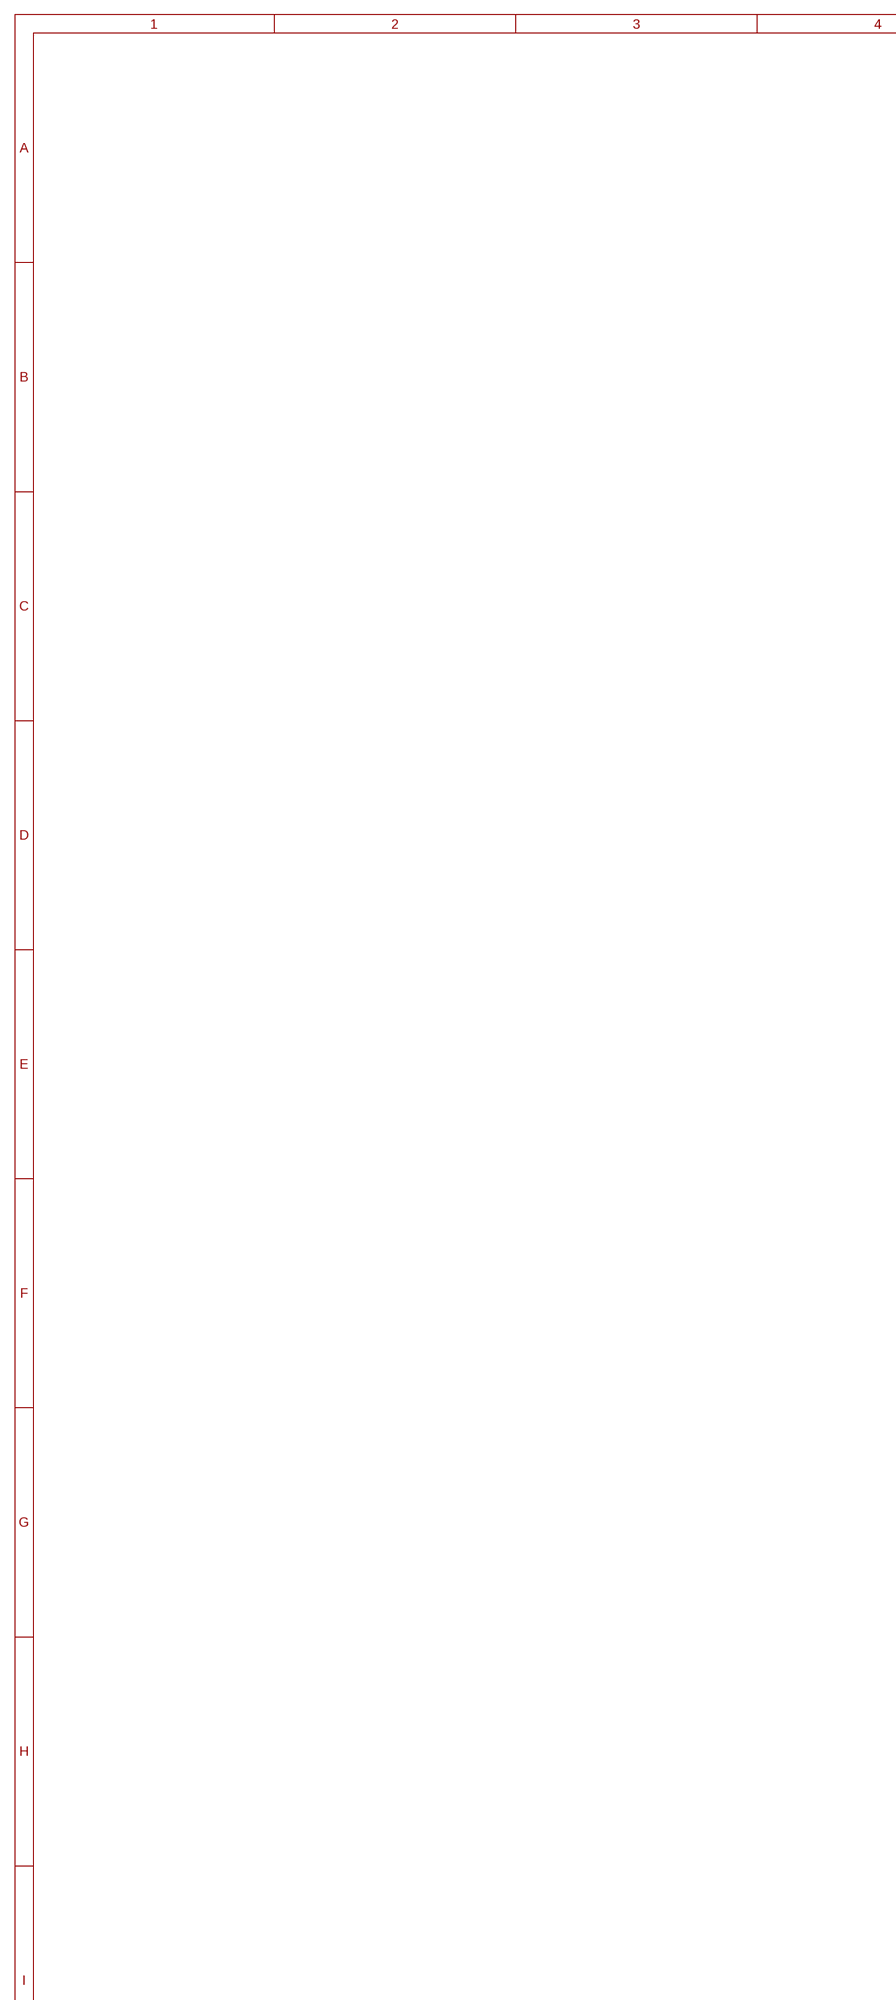
[diagram p6: schematic, sheet 4, part 1 of 2]
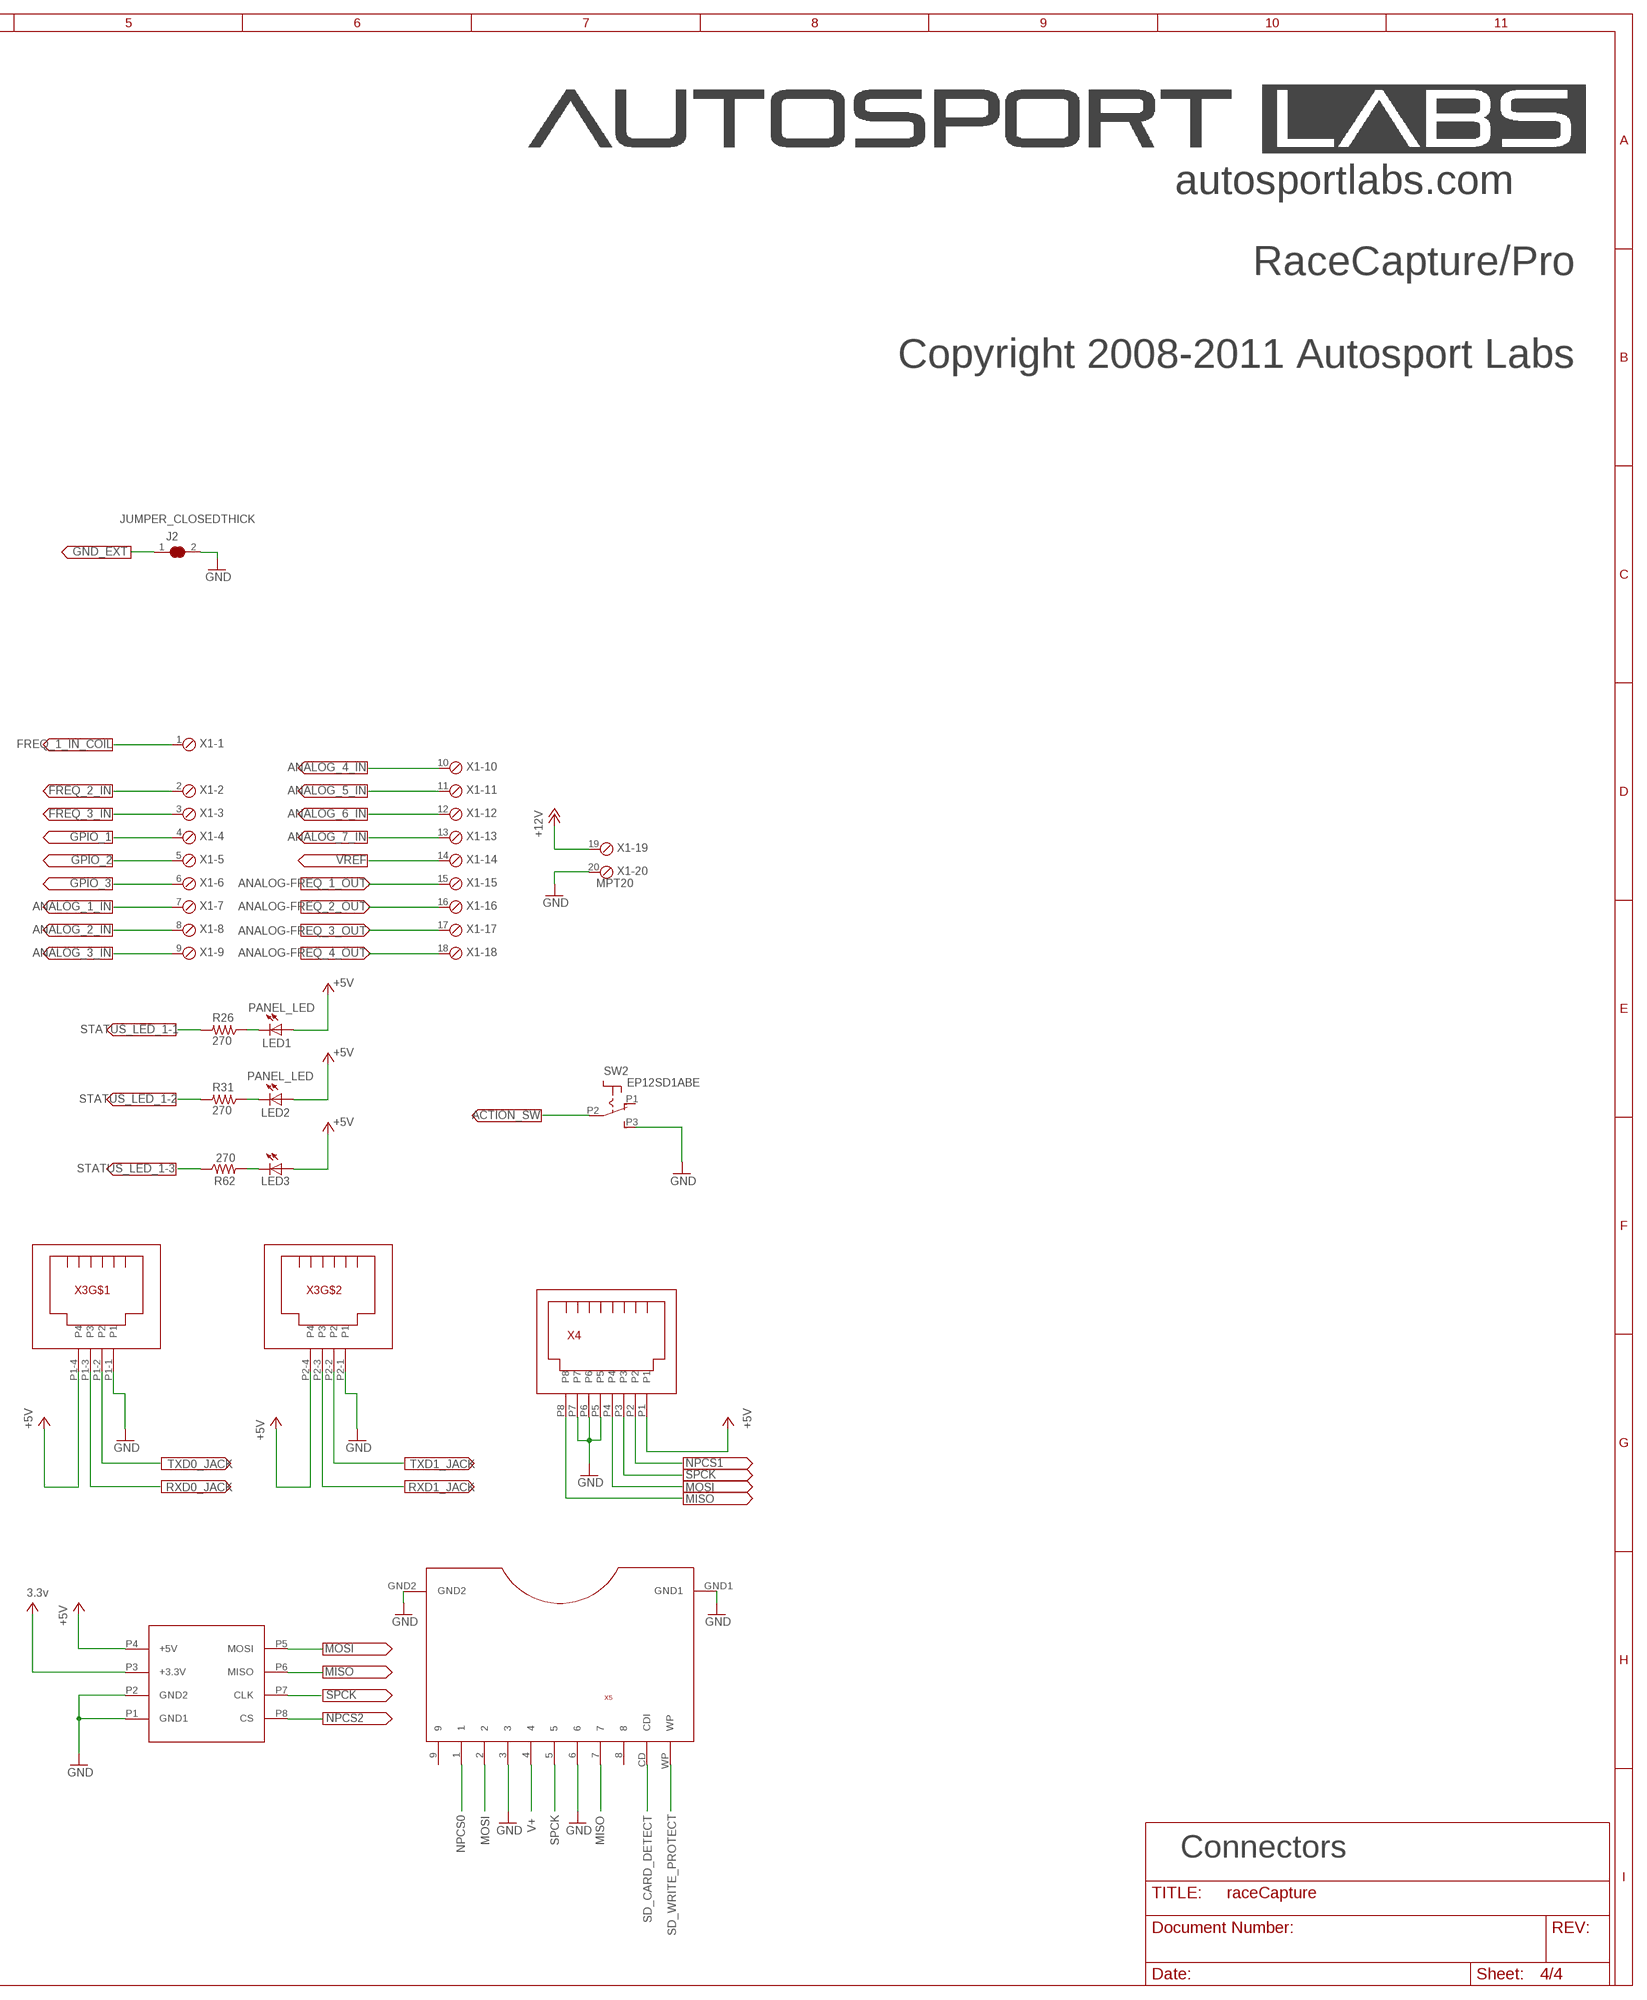
[diagram p7: schematic, sheet 4, part 2 of 2]

### Parts
J2  JUMPER_CLOSEDTHICK  [JUMPER_CLOSED_THICK]
LED1  PANEL_LED  [RIGHTANGLE_CML_5323F5]
LED2  PANEL_LED  [RIGHTANGLE_CML_5323F5]
LED3  LEDCHIPLED_0603  [CHIPLED_0603]
R26  270  R-US_R0603  [R0603]
R31  270  R-US_R0603  [R0603]
R62  270  R-US_R0603  [R0603]
SW2  EP12SD1ABE  [EP12SD1ABE]
U$1  ASL_ACCEL_MODULE  [ACCEL_MODULE]
X1  MPT20  [20POL35]
X3  GENERIC_DUAL_RJ11  [DUAL_RJ11_RIGHT_ANGLE_PCB]
X4  CNKLS_RJ45_SMT  [CNKLS_SMT_RJ45_JACK]
X5  CARD_CONNECTOR_SDFCI  [FCI_SD_CARD]

### Nets
+5V: LED1.A LED2.A LED3.A U$1.P4(+5V) X3.P1-4(P4) X3.P2-4(P4) X4.P1 ; also sheet 1,2,3
+12V: X1.19 ; also sheet 3
ACTION_SW: SW2.P2(P) ; also sheet 2
ANALOG-FREQ_1_OUT: X1.15 ; also sheet 1
ANALOG-FREQ_2_OUT: X1.16 ; also sheet 1
ANALOG-FREQ_3_OUT: X1.17 ; also sheet 1
ANALOG-FREQ_4_OUT: X1.18 ; also sheet 1
ANALOG_1_IN: X1.7 ; also sheet 1
ANALOG_2_IN: X1.8 ; also sheet 1
ANALOG_3_IN: X1.9 ; also sheet 1
ANALOG_4_IN: X1.10 ; also sheet 1
ANALOG_5_IN: X1.11 ; also sheet 1
ANALOG_6_IN: X1.12 ; also sheet 1
ANALOG_7_IN: X1.13 ; also sheet 1
FREQ_1_IN_COIL: X1.1 ; also sheet 1
FREQ_2_IN: X1.2 ; also sheet 1
FREQ_3_IN: X1.3 ; also sheet 1
GND: J2.2 SW2.P3(S) U$1.P1(GND1) U$1.P2(GND2) X1.20 X3.P1-1(P1) X3.P2-1(P1) X4.P5 X4.P6 X4.P7 X5.3 X5.6 X5.GND1 X5.GND2 ; also sheet 1,2,3
GND_EXT: J2.1 ; also sheet 1
GPIO_1: X1.4 ; also sheet 1
GPIO_2: X1.5 ; also sheet 1
GPIO_3: X1.6 ; also sheet 1
MISO: U$1.P6(MISO) X4.P8 X5.7 ; also sheet 2
MOSI: U$1.P5(MOSI) X4.P4 X5.2 ; also sheet 2
N$2: LED3.C R62.2
N$7: LED1.C R26.1
N$9: LED2.C R31.1
NPCS0: X5.1 ; also sheet 2
NPCS1: X4.P2 ; also sheet 2
NPCS2: U$1.P8(CS) ; also sheet 2
RXD0_JACK: X3.P1-3(P3) ; also sheet 1
RXD1_JACK: X3.P2-3(P3) ; also sheet 1
SD_CARD_DETECT: X5.CD(CDI) ; also sheet 2
SD_WRITE_PROTECT: X5.WP ; also sheet 2
SPCK: U$1.P7(CLK) X4.P3 X5.5 ; also sheet 2
STATUS_LED_1-1: R26.2 ; also sheet 2
STATUS_LED_1-2: R31.2 ; also sheet 2
STATUS_LED_1-3: R62.1 ; also sheet 2
TXD0_JACK: X3.P1-2(P2) ; also sheet 1
TXD1_JACK: X3.P2-2(P2) ; also sheet 1
V+: U$1.P3(+3.3V) X5.4 ; supply symbol labelled 3.3v ; also sheet 2
VREF: X1.14 ; also sheet 1
Unconnected: SW2.P1(O) X5.8 X5.9

### Notes on the sheet
- autosportlabs.com
- RaceCapture/Pro
- Copyright 2008-2011 Autosport Labs
- Connectors

## Library data of the parts
C1-C37 C39 C40 C42 C45-C56 C58-C63 = rcl:C-US: CAPACITOR, American symbol
C38 C41 C43 C44 C57 = rcl:CPOL-US: POLARIZED CAPACITOR, American symbol
D1-D7 D9-D21 = smt_diodes:ZENER
D8 D23 = smt_diodes:DIODE
D24 = polyzen:POLYZEN
D25 D26 = smt_diodes:SCHOTTKY
GPIO1-GPIO3 = jumper:JP2E: JUMPER
J2 = jumpers:JUMPER_CLOSED
L1 = smt_inductors:INDUCTOR
L2 = wuerth-elektronik:WE-CBF: SMD EMI Suppression Ferrite Beads - excellent anti-EMI properties - low DCR - impedances till 3000 ohms - rated current up to 6 A
L3 = sumida_inductors:CD54
LED1 LED2 PWR = LEDs:PANEL_LED
LED3 = led:LED: LED OSRAM: - CHIPLED LG R971, LG N971, LY N971, LG Q971, LY Q971, LO R971, LY R971 LH N974, LH R974 LS Q976, LO Q976, LY Q976 LO Q996 - Hyper CHIPLED LW Q18S LB Q993, LB Q99A, LB R99A - SideLED LS A670, LO A670, LY A670, LG A670, LP A670 LB A673, LV A673, LT A673, LW A673 LH A674 LY A675 LS A676, LA A676, LO A676, LY A676, LW A676 LS A679, LY A679, LG A679 - Hyper Micro SIDELED® LS Y876, LA Y876, LO Y876, LY Y876 LT Y87S - SmartLED LW L88C, LW L88S LB L89C, LB L89S, LG L890 LS L89K, LO L89K, LY L89K LS L896, LA L896, LO L896, LY L896 - TOPLED LS T670, LO T670, LY T670, LG T670, LP T670 LSG T670, LSP T670, LSY T670, LOP T670, LYG T670 LG T671, LOG T671, LSG T671 LB T673, LV T673, LT T673, LW T673 LH T674 LS T676, LA T676, LO T676, LY T676, LB T676, LH T676, LSB T676, LW T676 LB T67C, LV T67C, LT T67C, LS T67K, LO T67K, LY T67K, LW E67C LS E67B, LA E67B, LO E67B, LY E67B, LB E67C, LV E67C, LT E67C LW T67C LS T679, LY T679, LG T679 LS T770, LO T770, LY T770, LG T770, LP T770 LB T773, LV T773, LT T773, LW T773 LH T774 LS E675, LA E675, LY E675, LS T675 LS T776, LA T776, LO T776, LY T776, LB T776 LHGB T686 LT T68C, LB T68C - Hyper Mini TOPLED® LB M676 - Mini TOPLED Santana® LG M470 LS M47K, LO M47K, LY M47K Source: http://www.osram.convergy.de LUXEON: - LUMILED® LXK2-PW12-R00, LXK2-PW12-S00, LXK2-PW14-U00, LXK2-PW14-V00 LXK2-PM12-R00, LXK2-PM12-S00, LXK2-PM14-U00 LXK2-PE12-Q00, LXK2-PE12-R00, LXK2-PE12-S00, LXK2-PE14-T00, LXK2-PE14-U00 LXK2-PB12-K00, LXK2-PB12-L00, LXK2-PB12-M00, LXK2-PB14-N00, LXK2-PB14-P00, LXK2-PB14-Q00 LXK2-PR12-L00, LXK2-PR12-M00, LXK2-PR14-Q00, LXK2-PR14-R00 LXK2-PD12-Q00, LXK2-PD12-R00, LXK2-PD12-S00 LXK2-PH12-R00, LXK2-PH12-S00 LXK2-PL12-P00, LXK2-PL12-Q00, LXK2-PL12-R00 Source: www.luxeon.com KINGBRIGHT: KA-3528ASYC Source: www.kingbright.com
Q1 = crystal_smd:ABM8X
Q4 = transistor-small-signal:BSS84: P-CHANNEL MOS FET
R1-R10 R12 R13 R15-R62 = rcl:R-US_: RESISTOR, American symbol
RESET TEST = jumper:SJ: SMD solder JUMPER
SW1 = special:SW_DIP-4: DIP SWITCH
SW2 = misc_switch:EP12SD1ABE
SW3 SW4 = tactile_switch:6X3.5_TACT
U1-U3 = power_mosfets:ZXMS6004FF
U4 = optocoupler:TLP283: TOSHIBA PHOTOCOUPLER GaAs IRED & PHOTO-TRANSISTOR Source: http://www.semicon.toshiba.co.jp/td/en/Opto/Photocoupler/en_20050928_TLP283_datasheet.pdf
U5 = op_amps:TLV274
U6 = max232:HIN232A
U7 = voltage_regulators:FAN8303
U8 = mcp1700:MCP1700
U9 = atmel-arm:AT91SAM7S512/256/128/64/321: AT91SAM7S512/256/128/64/321 ARM7 Processor
U$1 = asl_accel_module:ASL_ACCEL_MODULE
U$2 = supercaps:SUPERCAP
X1 = pluggable_terminal_blocks:MPT20
X3 = FCI_RJ12:GENERIC_DUAL_RJ11
X4 = cnkls_parts:CNKLS_RJ45_SMT
X5 = SD_Card_connector:CARD_CONNECTOR_SD
X6 = cnkls_parts:MINI_USB_SHIELD